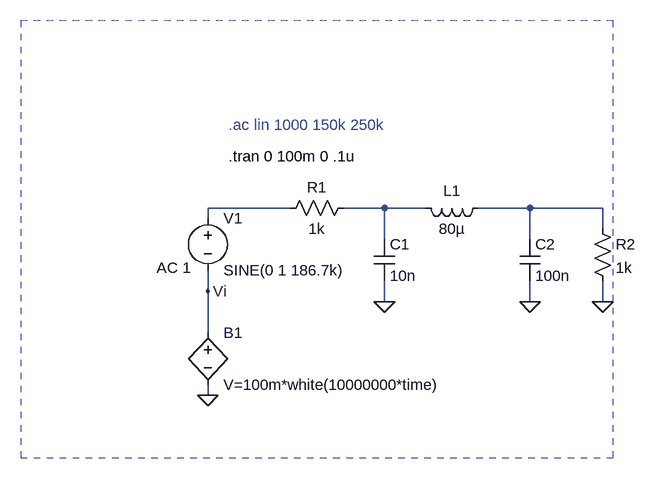
[diagram p0: schematic whitenoise.asc]
whitenoise.asc, the LTspice schematic file:
Version 4
SHEET 1 1876 680
WIRE -256 -1248 -384 -1248
WIRE -112 -1248 -176 -1248
WIRE -48 -1248 -112 -1248
WIRE 112 -1248 32 -1248
WIRE 224 -1248 112 -1248
WIRE -384 -1232 -384 -1248
WIRE 224 -1216 224 -1248
WIRE -112 -1200 -112 -1248
WIRE 112 -1200 112 -1248
WIRE -384 -1120 -384 -1152
WIRE -112 -1104 -112 -1136
WIRE 112 -1104 112 -1136
WIRE 224 -1104 224 -1136
WIRE -384 -1056 -384 -1120
WIRE -384 -960 -384 -976
FLAG -384 -960 0
FLAG -384 -1120 Vi
FLAG -112 -1104 0
FLAG 112 -1104 0
FLAG 224 -1104 0
SYMBOL bv -384 -1072 R0
SYMATTR InstName B1
SYMATTR Value V=100m*white(10000000*time)
SYMBOL res -160 -1264 R90
WINDOW 0 0 56 VBottom 2
WINDOW 3 32 56 VTop 2
SYMATTR InstName R1
SYMATTR Value 1k
SYMBOL cap -128 -1200 R0
SYMATTR InstName C1
SYMATTR Value 10n
SYMBOL ind 48 -1264 R90
WINDOW 0 5 56 VBottom 2
WINDOW 3 32 56 VTop 2
SYMATTR InstName L1
SYMATTR Value 80µ
SYMBOL cap 96 -1200 R0
SYMATTR InstName C2
SYMATTR Value 100n
SYMBOL res 208 -1232 R0
SYMATTR InstName R2
SYMATTR Value 1k
SYMBOL voltage -384 -1248 R0
WINDOW 123 -79 92 Left 2
WINDOW 39 0 0 Left 0
SYMATTR InstName V1
SYMATTR Value SINE(0 1 186.7k)
SYMATTR Value2 AC 1
TEXT -352 -1328 Left 2 !.tran 0 100m 0 .1u
TEXT -352 -1376 Left 2 ;.ac lin 1000 150k 250k
RECTANGLE Normal 240 -1536 -672 -864 2

The netlist it stands for:
* whitenoise.asc
B1 Vi 0 V=100m*white(10000000*time)
R1 N002 N001 1k
C1 N002 0 10n
L1 N003 N002 80µ
C2 N003 0 100n
R2 N003 0 1k
V1 N001 Vi SINE(0 1 186.7k) AC 1
.tran 0 100m 0 .1u
* .ac lin 1000 150k 250k
.backanno
.end